# EAGLE schematic untitled-Lite (EAGLE 9.5.2)
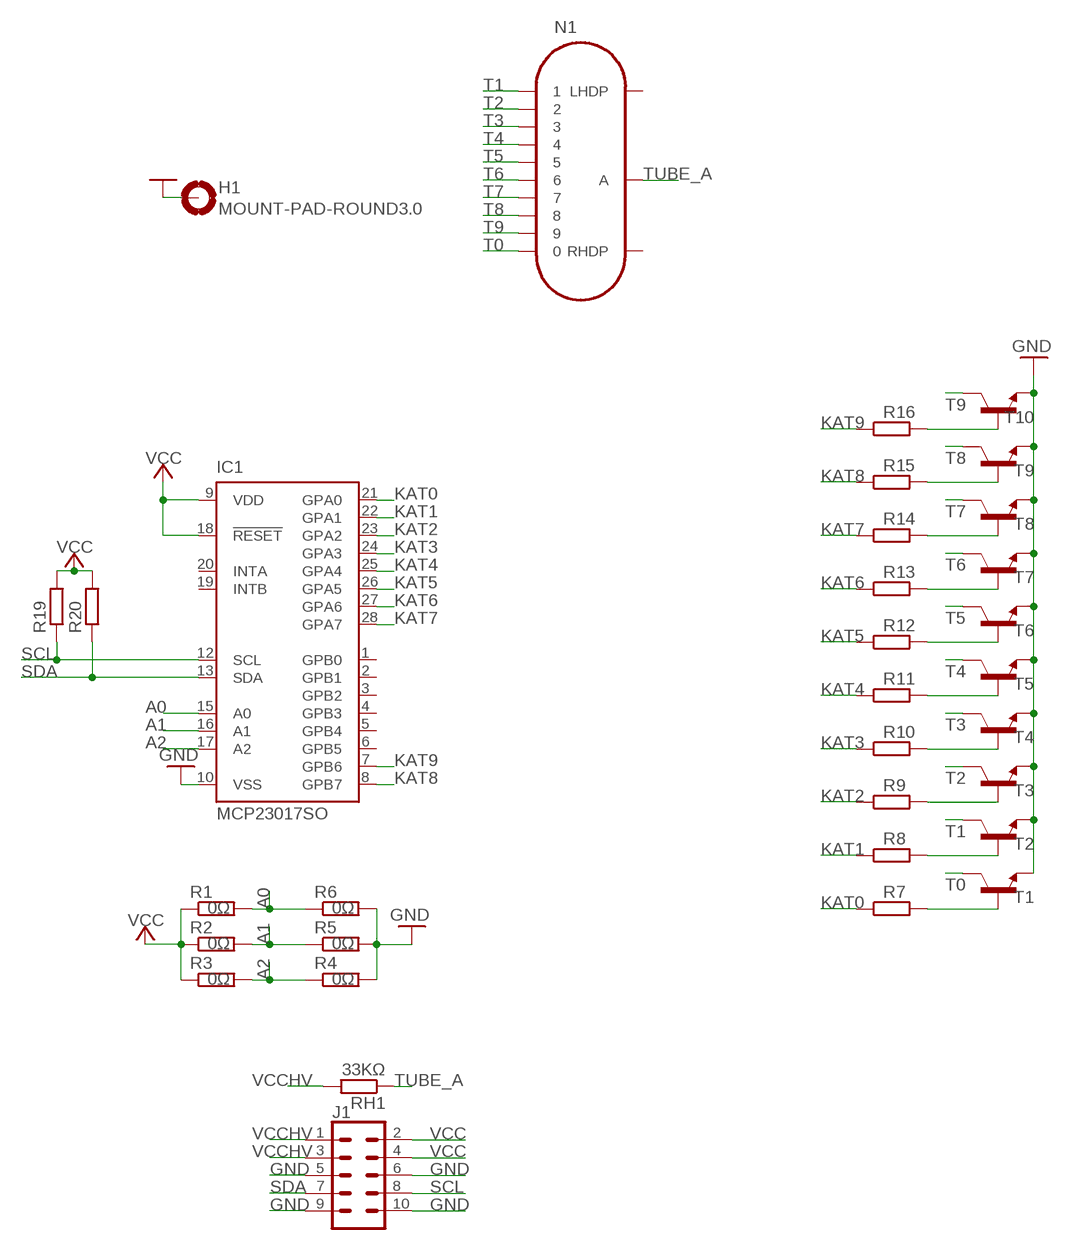
[diagram p0: schematic, sheet 1]

## Parts
H1  MOUNT-PAD-ROUND3.0  [3,0-PAD]
IC1  MCP23017SO  [SO28W]
J1  CONN_05X2PTH  [2X5]
N1  IN-14  [IN-14]
R1  0Ω  R-EU_R1206  [R1206]
R2  0Ω  R-EU_R1206  [R1206]
R3  0Ω  R-EU_R1206  [R1206]
R4  0Ω  R-EU_R1206  [R1206]
R5  0Ω  R-EU_R1206  [R1206]
R6  0Ω  R-EU_R1206  [R1206]
R7  R-EU_R1206  [R1206]
R8  R-EU_R1206  [R1206]
R9  R-EU_R1206  [R1206]
R10  R-EU_R1206  [R1206]
R11  R-EU_R1206  [R1206]
R12  R-EU_R1206  [R1206]
R13  R-EU_R1206  [R1206]
R14  R-EU_R1206  [R1206]
R15  R-EU_R1206  [R1206]
R16  R-EU_R1206  [R1206]
R19  R-EU_R1206  [R1206]
R20  R-EU_R1206  [R1206]
RH1  33KΩ  R-EU_0207/15  [0207/15]
T1  MMBTA42LT1-NPN-SOT23-BEC  [SOT23-BEC]
T2  MMBTA42LT1-NPN-SOT23-BEC  [SOT23-BEC]
T3  MMBTA42LT1-NPN-SOT23-BEC  [SOT23-BEC]
T4  MMBTA42LT1-NPN-SOT23-BEC  [SOT23-BEC]
T5  MMBTA42LT1-NPN-SOT23-BEC  [SOT23-BEC]
T6  MMBTA42LT1-NPN-SOT23-BEC  [SOT23-BEC]
T7  MMBTA42LT1-NPN-SOT23-BEC  [SOT23-BEC]
T8  MMBTA42LT1-NPN-SOT23-BEC  [SOT23-BEC]
T9  MMBTA42LT1-NPN-SOT23-BEC  [SOT23-BEC]
T10  MMBTA42LT1-NPN-SOT23-BEC  [SOT23-BEC]

## Nets
A0: IC1.15(A0) R1.2 R6.1
A1: IC1.16(A1) R2.2 R5.1
A2: IC1.17(A2) R3.2 R4.1
GND: H1.B3,0(MOUNT) IC1.10(VSS) J1.5 J1.6 J1.9 J1.10 R4.2 R5.2 R6.2 T1.E T2.E T3.E T4.E T5.E T6.E T7.E T8.E T9.E T10.E
KAT0: IC1.21(GPA0) R7.1
KAT1: IC1.22(GPA1) R8.1
KAT2: IC1.23(GPA2) R9.1
KAT3: IC1.24(GPA3) R10.1
KAT4: IC1.25(GPA4) R11.1
KAT5: IC1.26(GPA5) R12.1
KAT6: IC1.27(GPA6) R13.1
KAT7: IC1.28(GPA7) R14.1
KAT8: IC1.8(GPB7) R15.1
KAT9: IC1.7(GPB6) R16.1
N$2: R7.2 T1.B
N$3: R16.2 T10.B
N$4: R15.2 T9.B
N$5: R14.2 T8.B
N$6: R13.2 T7.B
N$7: R12.2 T6.B
N$8: R11.2 T5.B
N$9: R10.2 T4.B
N$10: R9.2 T3.B
N$11: R8.2 T2.B
SCL: IC1.12(SCL) J1.8 R19.1
SDA: IC1.13(SDA) J1.7 R20.1
T0: N1.0 T1.C
T1: N1.1 T2.C
T2: N1.2 T3.C
T3: N1.3 T4.C
T4: N1.4 T5.C
T5: N1.5 T6.C
T6: N1.6 T7.C
T7: N1.7 T8.C
T8: N1.8 T9.C
T9: N1.9 T10.C
TUBE_A: N1.A RH1.1
VCC: IC1.9(VDD) IC1.18(!RESET) J1.2 J1.4 R1.1 R2.1 R3.1 R19.2 R20.2
VCCHV: J1.1 J1.3 RH1.2
Unconnected: IC1.1(GPB0) IC1.2(GPB1) IC1.3(GPB2) IC1.4(GPB3) IC1.5(GPB4) IC1.6(GPB5) IC1.19(INTB) IC1.20(INTA) N1.LHDP N1.RHDP

## Library data of the parts
H1 = holes:MOUNT-PAD-ROUND: MOUNTING PAD, round
IC1 = adafruit:MCP23017: http://ww1.microchip.com/downloads/en/DeviceDoc/21952a.pdf Source: http://ww1.microchip.com/downloads/en/DeviceDoc/21952a.pdf
J1 = SparkFun-Connectors:CONN_05X2: Multi connection point. Often used as Generic Header-pin footprint for 0.1 inch spaced/style header connections For AVR SPI programming port, see special device with nice symbol: "AVR_SPI_PROG_5x2.dev" You can populate with any combo of single row headers, but if you'd like an exact match, check these: 2x5 AVR ICSP Male Header <https://www.sparkfun.com/products/778> (PRT-00778) 2x5 Pin Shrouded Header <https://www.sparkfun.com/products/8506> (PRT-08506) On any of the 0.1 inch spaced packages, you can populate with these: Break Away Headers - Straight <https://www.sparkfun.com/products/116> (PRT-00116) Break Away Male Headers - Right Angle <https://www.sparkfun.com/products/553> (PRT-00553) Female Headers <https://www.sparkfun.com/products/115> (PRT-00115) Break Away Headers - Machine Pin <https://www.sparkfun.com/products/117> (PRT-00117) Break Away Female Headers - Swiss Machine Pin <https://www.sparkfun.com/products/743> (PRT-00743) Special note: the shrouded connector mates well with our 5x2 ribbon cables: 2x5 Pin IDC Ribbon Cable <https://www.sparkfun.com/products/8535> (PRT-08535); PROD_ID: CONN-08499; SF_ID: PRT-0778
N1 = russian-nixies:IN-14: IN-14: medium numeric frontview nixie tube
R1-R16 R19 R20 RH1 = resistor:R-EU_: RESISTOR, European symbol
T1-T10 = transistor:*-NPN-: NPN Transistror BF959 corrected 2008.03.06